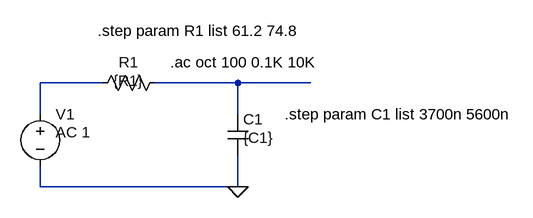
[diagram p0: schematic Livrable N°1_Passe_bas.asc]
Livrable N°1_Passe_bas.asc, the LTspice schematic file:
Version 4
SHEET 1 880 680
WIRE 112 96 16 96
WIRE 320 96 192 96
WIRE 432 96 320 96
WIRE 16 144 16 96
WIRE 320 144 320 96
WIRE 16 256 16 224
WIRE 320 256 320 208
WIRE 320 256 16 256
FLAG 320 256 0
SYMBOL voltage 16 128 R0
WINDOW 123 24 44 Left 2
WINDOW 39 0 0 Left 0
SYMATTR Value2 AC 1
SYMATTR InstName V1
SYMATTR Value ""
SYMBOL res 208 80 R90
WINDOW 0 0 56 VBottom 2
WINDOW 3 28 56 VBottom 2
SYMATTR InstName R1
SYMATTR Value {R1}
SYMBOL cap 304 144 R0
WINDOW 3 24 36 Left 2
SYMATTR Value {C1}
SYMATTR InstName C1
TEXT 216 64 Left 2 !.ac oct 100 0.1K 10K
TEXT 104 16 Left 2 !.step param R1 list 61.2 74.8
TEXT 392 144 Left 2 !.step param C1 list 3700n 5600n

The netlist it stands for:
* Livrable N°1_Passe_bas.asc
V1 N001 0 AC 1
R1 N002 N001 {R1}
C1 N002 0 {C1}
.ac oct 100 0.1K 10K
.step param R1 list 61.2 74.8
.step param C1 list 3700n 5600n
.backanno
.end